# Altium schematic sheet Bluetooth.SchDoc
size A4
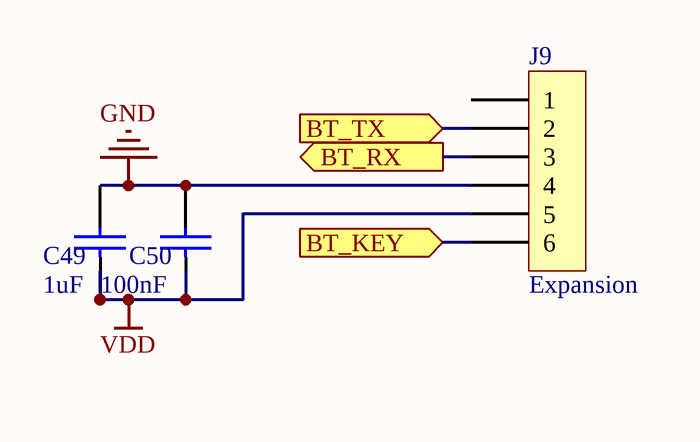
[diagram p0: Bluetooth.SchDoc]

## Parts
C49  value 1uF  [0805]  (hidden comment: Capacitor)
C50  value 100nF  [0805]  (hidden comment: Capacitor)
J9  Expansion  [SIP6]

## Ports
BT_KEY (in), BT_RX (out), BT_TX (in)

## Nets
GND: C49.2 C50.2 J9.4
VDD: C49.1 C50.1 J9.5
BT_KEY: J9.6 ; port BT_KEY
BT_RX: J9.3 ; port BT_RX
BT_TX: J9.2 ; port BT_TX

Not connected (* = marked no-connect by the designer): J9 1

## Library data of the parts
C49 C50 = Capacitor: Dielectric: X5R; Voltage: *
J9 = CON6